# Altium schematic sheet PART-05-加分电路R250-299.SchDoc
size A4
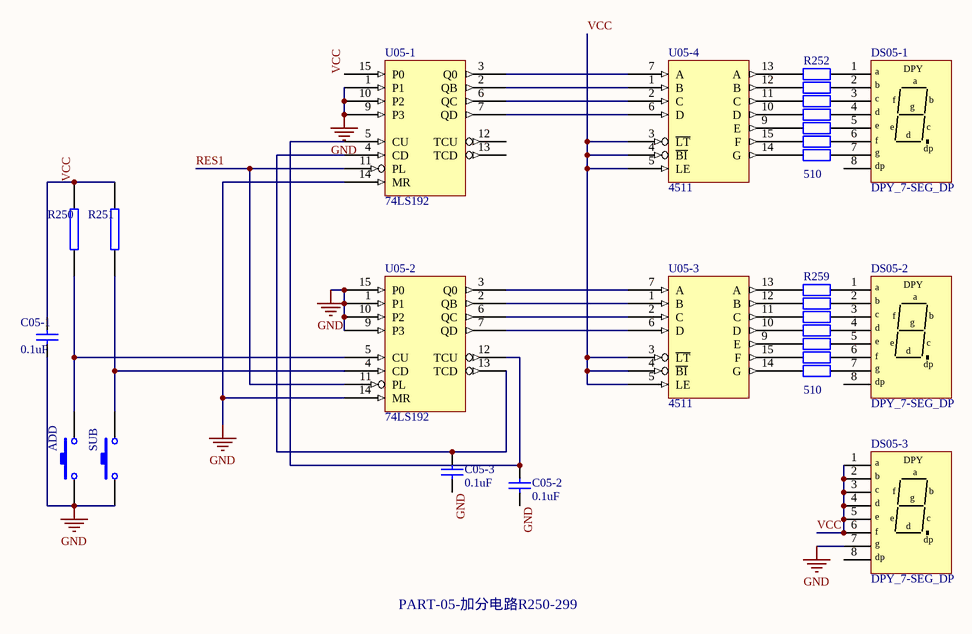
[diagram p0: PART-05-加分电路R250-299.SchDoc]

## Parts
ADD  SW-PB  [SPST-2]  (value not drawn)
C05-1  value 0.1uF  [RAD-0.3]  (hidden comment: Cap)
C05-2  value 0.1uF  [RAD-0.3]  (hidden comment: Cap)
C05-3  value 0.1uF  [RAD-0.3]  (hidden comment: Cap)
DS05-1  DPY_7-SEG_DP  [8-.5]
DS05-2  DPY_7-SEG_DP  [8-.5]
DS05-3  DPY_7-SEG_DP  [8-.5]
R250  ES2  (value not drawn)
R251  ES2  (value not drawn)
R252  value 510  [AXIAL-0.4]  (hidden comment: Res2)
R253  Res2  [AXIAL-0.4]  (value not drawn)
R254  Res2  [AXIAL-0.4]  (value not drawn)
R255  Res2  [AXIAL-0.4]  (value not drawn)
R256  Res2  [AXIAL-0.4]  (value not drawn)
R257  Res2  [AXIAL-0.4]  (value not drawn)
R258  Res2  [AXIAL-0.4]  (value not drawn)
R259  value 510  [AXIAL-0.4]  (hidden comment: Res2)
R260  Res2  [AXIAL-0.4]  (value not drawn)
R261  Res2  [AXIAL-0.4]  (value not drawn)
R262  Res2  [AXIAL-0.4]  (value not drawn)
R263  Res2  [AXIAL-0.4]  (value not drawn)
R264  Res2  [AXIAL-0.4]  (value not drawn)
R265  Res2  [AXIAL-0.4]  (value not drawn)
SUB  SW-PB  [SPST-2]  (value not drawn)
U05-1  74LS192  [DIP-16]
U05-2  74LS192  [DIP-16]
U05-3  4511  [DIP-16]
U05-4  4511  [DIP-16]

## Nets
GND: ADD.1 C05-1.1 C05-2.1 C05-3.1 DS05-3.7(g) SUB.1 U05-1.1(P1) U05-1.8(GND) U05-1.9(P3) U05-1.10(P2) U05-1.14(MR) U05-2.1(P1) U05-2.8(GND) U05-2.9(P3) U05-2.10(P2) U05-2.14(MR) U05-2.15(P0) U05-3.8(GND) U05-4.8(GND)
VCC: C05-1.2 DS05-3.1(a) DS05-3.2(b) DS05-3.3(c) DS05-3.4(d) DS05-3.5(e) DS05-3.6(f) R250.2 R251.2 U05-1.15(P0) U05-1.16(VCC) U05-2.16(VCC) U05-3.3(~{LT}) U05-3.4(~{BI}) U05-3.5(LE) U05-3.16(VCC) U05-4.3(~{LT}) U05-4.4(~{BI}) U05-4.5(LE) U05-4.16(VCC)
RES1: U05-1.11(PL) U05-2.11(PL)
NetADD_2: ADD.2 R250.1 U05-2.5(CU)
NetC05-2_2: C05-2.2 U05-1.5(CU) U05-2.12(TCU)
NetC05-3_2: C05-3.2 U05-1.4(CD) U05-2.13(TCD)
NetDS05-1_1: DS05-1.1(a) R252.2
NetDS05-1_2: DS05-1.2(b) R253.2
NetDS05-1_3: DS05-1.3(c) R254.2
NetDS05-1_4: DS05-1.4(d) R255.2
NetDS05-1_5: DS05-1.5(e) R256.2
NetDS05-1_6: DS05-1.6(f) R257.2
NetDS05-1_7: DS05-1.7(g) R258.2
NetDS05-2_1: DS05-2.1(a) R259.2
NetDS05-2_2: DS05-2.2(b) R260.2
NetDS05-2_3: DS05-2.3(c) R261.2
NetDS05-2_4: DS05-2.4(d) R262.2
NetDS05-2_5: DS05-2.5(e) R263.2
NetDS05-2_6: DS05-2.6(f) R264.2
NetDS05-2_7: DS05-2.7(g) R265.2
NetR251_1: R251.1 SUB.2 U05-2.4(CD)
NetR252_1: R252.1 U05-4.13(A)
NetR253_1: R253.1 U05-4.12(B)
NetR254_1: R254.1 U05-4.11(C)
NetR255_1: R255.1 U05-4.10(D)
NetR256_1: R256.1 U05-4.9(E)
NetR257_1: R257.1 U05-4.15(F)
NetR258_1: R258.1 U05-4.14(G)
NetR259_1: R259.1 U05-3.13(A)
NetR260_1: R260.1 U05-3.12(B)
NetR261_1: R261.1 U05-3.11(C)
NetR262_1: R262.1 U05-3.10(D)
NetR263_1: R263.1 U05-3.9(E)
NetR264_1: R264.1 U05-3.15(F)
NetR265_1: R265.1 U05-3.14(G)
NetU05-1_2: U05-1.2(QB) U05-4.1(B)
NetU05-1_3: U05-1.3(Q0) U05-4.7(A)
NetU05-1_6: U05-1.6(QC) U05-4.2(C)
NetU05-1_7: U05-1.7(QD) U05-4.6(D)
NetU05-2_2: U05-2.2(QB) U05-3.1(B)
NetU05-2_3: U05-2.3(Q0) U05-3.7(A)
NetU05-2_6: U05-2.6(QC) U05-3.2(C)
NetU05-2_7: U05-2.7(QD) U05-3.6(D)

Not connected (* = marked no-connect by the designer): DS05-1 8(dp); DS05-2 8(dp); DS05-3 8(dp); U05-1 12(TCU) 13(TCD)

## Notes on the sheet
- PART-05-加分电路R250-299
- (in symbol DPY_7-SEG_DP) DPY

## Library data of the parts
ADD SUB = SW-PB: Switch; Published: 24-Mar-1999; LatestRevisionDate: 17-Jul-2002; LatestRevisionNote: Re-released for DXP Platform.; PackageReference: SPST-2; Publisher: Altium Limited
C05-1-C05-3 = Cap: Capacitor; Published: 8-Jun-2000; LatestRevisionDate: 17-Jul-2002; LatestRevisionNote: Re-released for DXP Platform.; PackageReference: RAD-0.3; Publisher: Altium Limited
DS05-1-DS05-3 = DPY_7-SEG_DP: Seven-Segment Display, Right Hand Decimal
R250 R251 = RES2
R252 R259 = Res2: Resistor; Published: 8-Jun-2000; LatestRevisionDate: 17-Jul-2002; LatestRevisionNote: Re-released for DXP Platform.; PackageReference: AXIAL-0.4; Publisher: Altium Limited
R253-R258 R260-R265 = Res2: Resistor; Value: 510; Published: 8-Jun-2000; LatestRevisionDate: 17-Jul-2002; LatestRevisionNote: Re-released for DXP Platform.; PackageReference: AXIAL-0.4; Publisher: Altium Limited
U05-1 U05-2 = 74HC192